# EasyEDA schematic Hexagon Robot1.json
TITLE: Hexagon Robot; REV: 1.0; Date: 2024-03-17; Sheet: 1/1; Drawn By: Shane Wood Logan Martin
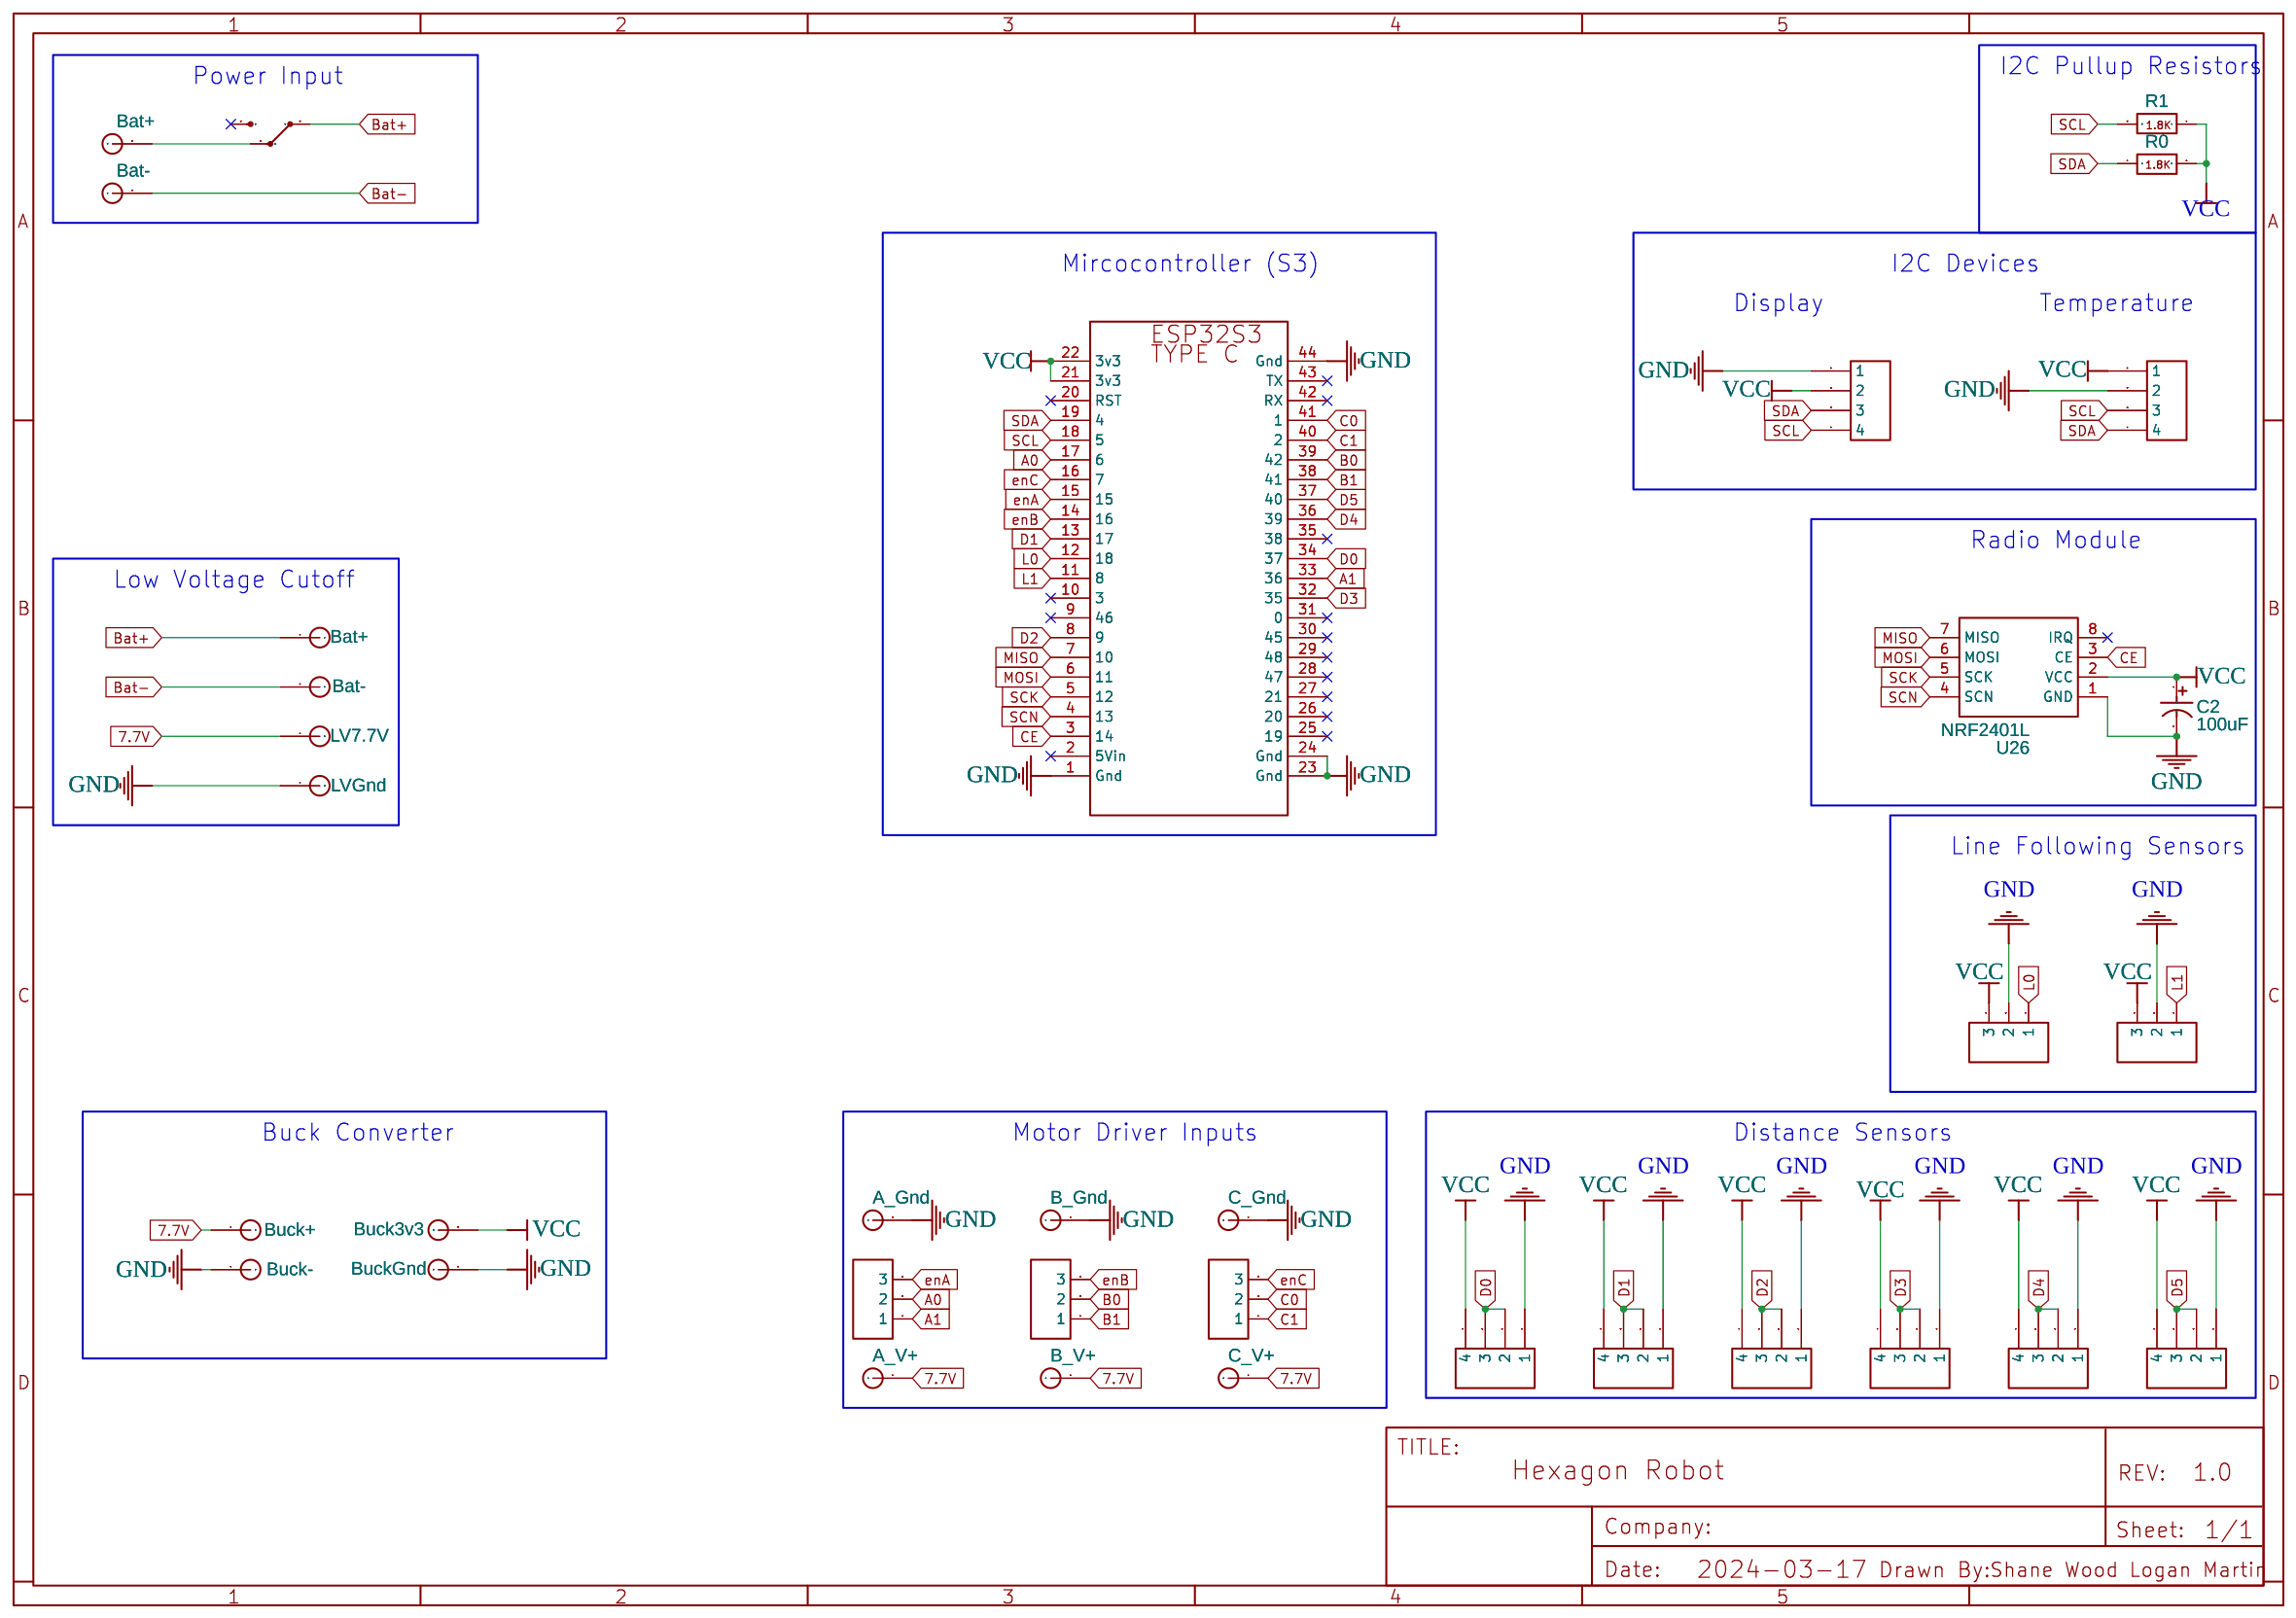
[diagram p0: schematic sheet]

## Parts
C2  100uF  [100UFX16V CAPACITOR D5.0XF11.0]
H1  Bat+  [14AWG PTH LARGE]
H2  Bat-  [14AWG PTH LARGE]
H3  Bat+  [14AWG PTH LARGE]
H4  LVGnd  [14AWG PTH LARGE]
H5  Bat-  [14AWG PTH LARGE]
H6  LV7.7V  [14AWG PTH LARGE]
H11  A_Gnd  [14AWG PTH LARGE]
H12  B_Gnd  [14AWG PTH LARGE]
H13  C_Gnd  [14AWG PTH LARGE]
H14  A_V+  [14AWG PTH LARGE]
H15  B_V+  [14AWG PTH LARGE]
H16  C_V+  [14AWG PTH LARGE]
H17  Buck+  [14AWG PTH LARGE]
H18  Buck-  [14AWG PTH LARGE]
H19  Buck3v3  [14AWG PTH LARGE]
H20  BuckGnd  [14AWG PTH LARGE]
P9  Header-Female-2.54_1x3  [HDR-3X1/2.54]
P10  Header-Female-2.54_1x3  [HDR-3X1/2.54]
P11  Header-Female-2.54_1x3  [HDR-3X1/2.54]
P12  Header-Female-2.54_1x3  [HDR-3X1/2.54]
P13  Header-Female-2.54_1x3  [HDR-3X1/2.54]
R3  R1  [1.8K RESISTOR 1/2W]
R4  R0  [1.8K RESISTOR 1/2W]
U2  NO  [HDR-4X1/2.54]
U3  ESP32S3 TypeC  [ESP32S3 TYPEC]
U22  NO  [TOGGLE SWITCH SPDT RED 3 PIN ON-OFF-ON 3 SPDT SMALL AC 6A/125V 3A/250V]
U26  NRF2401L  [NRF2401L]
U28  NO  [HDR-4X1/2.54]
U29  NO  [HDR-4X1/2.54]
U30  NO  [HDR-4X1/2.54]
U31  NO  [HDR-4X1/2.54]
U32  NO  [HDR-4X1/2.54]
U33  NO  [HDR-4X1/2.54]
U35  NO  [HDR-4X1/2.54]

## Library data of the parts
C2 = CAP-POL-1: Supplier: My_collection; Manufacturer Part: Jweo; Rated Voltage: 16V; Contributor: stefanczykdk
H1-H6 H11-H20 = Wire Hole 14AWG: Manufacturer Part: Wire Hole; Contributor: dropTarget
P9-P13 = Header-Female-2.54_1x3: Supplier: LCSC; Manufacturer: ReliaPro; Manufacturer Part: Header-Female-2.54_1x4; Supplier Part: C124413; Contributor: resende.vitor
R3 R4 = 1.8K_R_1/2W: Contributor: jokosays
U2 U28-U33 U35 = Header-Female-2.54_1x4: Manufacturer: ReliaPro; Manufacturer Part: Female header pitch2.54mm; Contributor: akula26
U3 = ESP32S3 TypeC: Contributor: Guest
U22 = TOGGLESWITCH SPST_SWITCH-SPDT COPY: sourceId: ceKgMGAuL; Contributor: hanzfortun09
U26 = NRF2401L: Manufacturer Part: nrf2401l; Contributor: freddyka

## Nets
7.7V: H6.1 H14.1 H15.1 H16.1 H17.1
GND: C2.2 H4.1 H11.1 H12.1 H13.1 H18.1 H20.1 P9.2 P10.2 U2.1 U3.1(Gnd) U3.23(Gnd) U3.24(Gnd) U3.44(Gnd) U26.1(GND) U28.1 U29.1 U30.1 U31.1 U32.1 U33.1 U35.2
VCC: C2.1 H19.1 P9.3 P10.3 R3.1 R4.2 U2.2 U3.21(3v3) U3.22(3v3) U26.2(VCC) U28.4 U29.4 U30.4 U31.4 U32.4 U33.4 U35.1
A0: P11.2 U3.17(6)
A1: P11.1 U3.33(36)
B0: P12.2 U3.39(42)
B1: P12.1 U3.38(41)
Bat+: H3.1 U22.2(P)
Bat-: H2.1 H5.1
C0: P13.2 U3.41(1)
C1: P13.1 U3.40(2)
CE: U3.3(14) U26.3(CE)
D0: U3.34(37) U28.2 U28.3
D1: U3.13(17) U29.2 U29.3
D2: U3.8(9) U30.2 U30.3
D3: U3.32(35) U31.2 U31.3
D4: U3.36(39) U32.2 U32.3
D5: U3.37(40) U33.2 U33.3
enA: P11.3 U3.15
enB: P12.3 U3.14(16)
enC: P13.3 U3.16(7)
L0: P9.1 U3.12(18)
L1: P10.1 U3.11(8)
MISO: U3.7(10) U26.7(MISO)
MOSI: U3.6(11) U26.6(MOSI)
SCK: U3.5(12) U26.5(SCK)
SCL: R3.2 U2.4 U3.18(5) U35.3
SCN: U3.4(13) U26.4(SCN)
SDA: R4.1 U2.3 U3.19(4) U35.4
Net-(H1-1): H1.1 U22.1(O)

Not connected (* = marked no-connect by the designer): U3 2(5Vin)* 9(46)* 10(3)* 20(RST)* 25(19)* 26(20)* 27(21)* 28(47)* 29(48)* 30(45)* 31(0)* 35(38)* 42(RX)* 43(TX)*; U22 3(S)*; U26 8(IRQ)*

## Notes on the sheet
- Power Input
- I2C Pullup Resistors
- Mircocontroller (S3)
- I2C Devices
- Display
- Temperature
- Radio Module
- Low Voltage Cutoff
- Line Following Sensors
- Buck Converter
- Motor Driver Inputs
- Distance Sensors
